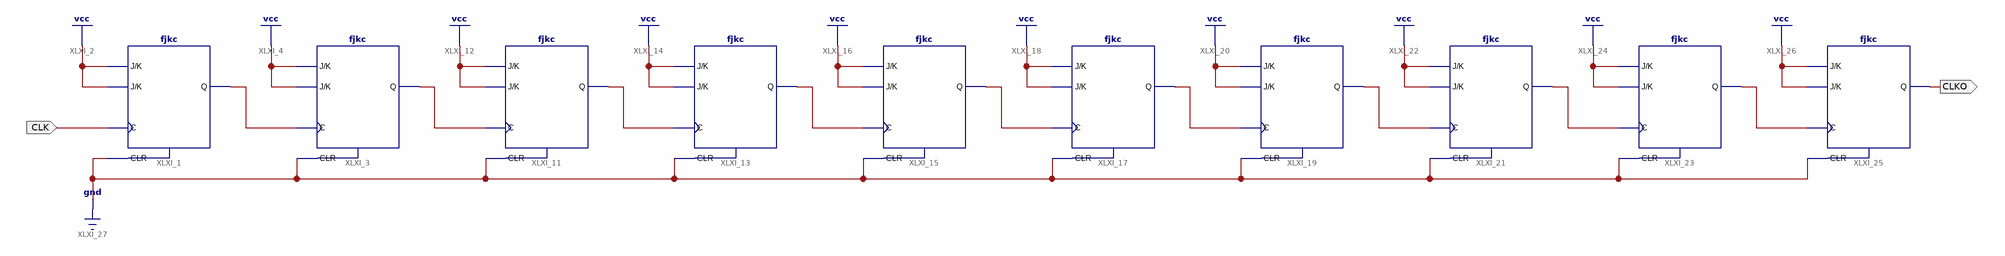
[diagram p0: schematic sheet 1]
// Xilinx ISE schematic clkdiv1ki.sch (spartan6) as structural Verilog: 10 symbols, 2 ports
module clkdiv1ki (
  input  CLK,
  output CLKO
);

  wire XLXN_5, XLXN_13, XLXN_15, XLXN_17, XLXN_19, XLXN_21, XLXN_23, XLXN_25, XLXN_27;

  fjkc XLXI_1 (.C(CLK), .CLR(1'b0), .J(1'b1), .K(1'b1), .Q(XLXN_5));
  fjkc XLXI_3 (.C(XLXN_5), .CLR(1'b0), .J(1'b1), .K(1'b1), .Q(XLXN_13));
  fjkc XLXI_11 (.C(XLXN_13), .CLR(1'b0), .J(1'b1), .K(1'b1), .Q(XLXN_15));
  fjkc XLXI_13 (.C(XLXN_15), .CLR(1'b0), .J(1'b1), .K(1'b1), .Q(XLXN_17));
  fjkc XLXI_15 (.C(XLXN_17), .CLR(1'b0), .J(1'b1), .K(1'b1), .Q(XLXN_19));
  fjkc XLXI_17 (.C(XLXN_19), .CLR(1'b0), .J(1'b1), .K(1'b1), .Q(XLXN_21));
  fjkc XLXI_19 (.C(XLXN_21), .CLR(1'b0), .J(1'b1), .K(1'b1), .Q(XLXN_23));
  fjkc XLXI_21 (.C(XLXN_23), .CLR(1'b0), .J(1'b1), .K(1'b1), .Q(XLXN_25));
  fjkc XLXI_23 (.C(XLXN_25), .CLR(1'b0), .J(1'b1), .K(1'b1), .Q(XLXN_27));
  fjkc XLXI_25 (.C(XLXN_27), .CLR(1'b0), .J(1'b1), .K(1'b1), .Q(CLKO));
endmodule
